# EAGLE design DCDC-5VXV3A (EAGLE 9.6.2)
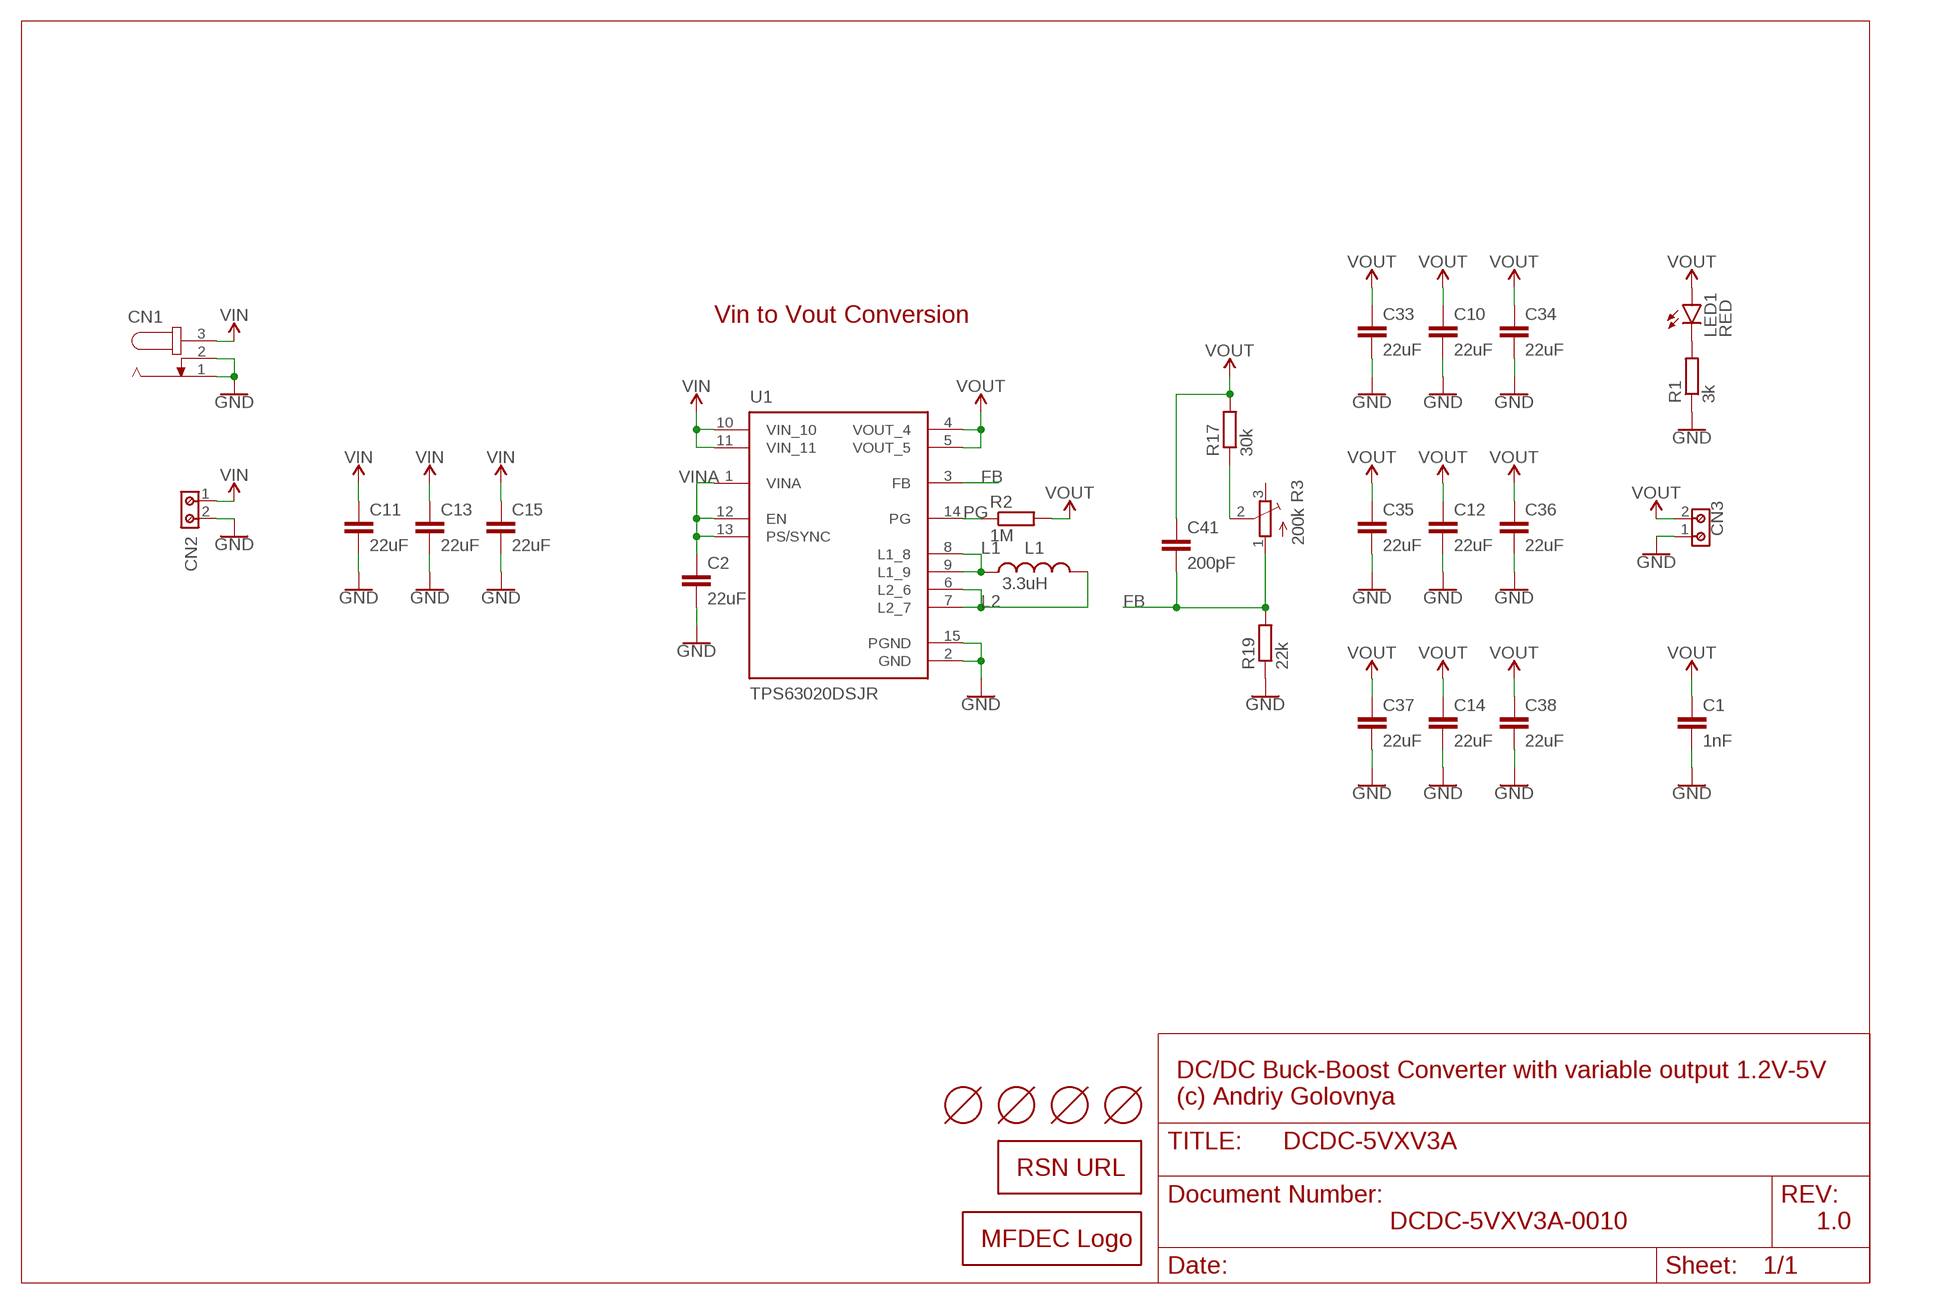
[diagram p0: schematic, sheet 1]

## Parts
C1  1nF  C-EUC0603K  [C0603K]
C2  22uF  C-EUC0805K  [C0805K]
C10  22uF  C-EUC0805K  [C0805K]
C11  22uF  C-EUC0805K  [C0805K]
C12  22uF  C-EUC0805K  [C0805K]
C13  22uF  C-EUC0805K  [C0805K]
C14  22uF  C-EUC0805K  [C0805K]
C15  22uF  C-EUC0805K  [C0805K]
C33  22uF  C-EUC0805K  [C0805K]
C34  22uF  C-EUC0805K  [C0805K]
C35  22uF  C-EUC0805K  [C0805K]
C36  22uF  C-EUC0805K  [C0805K]
C37  22uF  C-EUC0805K  [C0805K]
C38  22uF  C-EUC0805K  [C0805K]
C41  200pF  C-EUC0603K  [C0603K]
CN1  JACK-PLUG1  [SPC4078]
CN2  691213510002  [691213510002]
CN3  691213510002  [691213510002]
HOLE1  TOOLINGHOLE  [TOOLING-HOLE]
HOLE2  TOOLINGHOLE  [TOOLING-HOLE]
HOLE3  TOOLINGHOLE  [TOOLING-HOLE]
HOLE4  TOOLINGHOLE  [TOOLING-HOLE]
L1  3.3uH  WE-CHSA_1011_7843330330  [WE-CHSA_1011]
LED1  RED  LEDSML0603  [SML0603]
LOGO1  RSNURL_QR_8MM  [RSNURL_QR_8MM]
LOGO2  MFDECLOGO_L_10MM  [MFDEC_L_10MM]
R1  3k  R-EU_R0603  [R0603]
R2  1M  R-EU_R0603  [R0603]
R3  200k  TRIMPOTTC33X  [TC33X]
R17  30k  R-EU_R0603  [R0603]
R19  22k  R-EU_R0603  [R0603]
U1  TPS63020DSJR  [IC_TPS63020DSJR]

## Nets
FB: C41.2 R3.1(A) R19.2 U1.3(FB)
GND: C1.2 C2.2 C10.2 C11.2 C12.2 C13.2 C14.2 C15.2 C33.2 C34.2 C35.2 C36.2 C37.2 C38.2 CN1.1 CN1.2 CN2.2 CN3.1 R1.1 R19.1 U1.2(GND) U1.15(PGND)
L1: L1.1 U1.8(L1_8) U1.9(L1_9)
L2: L1.2 U1.6(L2_6) U1.7(L2_7)
N$1: LED1.C R1.2
N$2: R3.2(S) R17.1
PG: R2.1 U1.14(PG)
VIN: C11.1 C13.1 C15.1 CN1.3 CN2.1 U1.10(VIN_10) U1.11(VIN_11)
VINA: C2.1 U1.1(VINA) U1.12(EN) U1.13(PS/SYNC)
VOUT: C1.1 C10.1 C12.1 C14.1 C33.1 C34.1 C35.1 C36.1 C37.1 C38.1 C41.1 CN3.2 LED1.A R2.2 R17.2 U1.4(VOUT_4) U1.5(VOUT_5)
Unconnected: R3.3(E)

## Notes on the sheet
- Vin to Vout Conversion
- DC/DC Buck-Boost Converter with variable output 1.2V-5V
  (c) Andriy Golovnya
- DCDC-5VXV3A-0010 | 1.0

## Library data of the parts
C1 C2 C10-C15 C33-C38 C41 = rcl:C-EU: CAPACITOR, European symbol; SPICEPREFIX: C
CN1 = con-jack:JACK-PLUG: DC POWER JACK Power Jack, DC, Right Angle, Through Hole, Rated 5A at 16VDC, PC Terminals Distributor: Farnell (www.Farnell.de) Drawing: 84N1161.pdf / 84N1162.pdf Manufacturer: SPC Technology (www.spctechnology.com) Type: SPC4077 / SPC 4078; OC_FARNELL: unknown; OC_NEWARK: unknown
CN2 CN3 = Wurth_Connectors_WR-TBL Rising Cage Clamp:691213510002: WR-TBL Serie 2135 - 5.08 mm Horizontal Entry Modular w. Rising Cage Clamp KIND PROPERTIES Pitch 5.08 mm MATERIAL PROPERTIES Insulator Material PA66 Insulator Flammability Rating UL94 V-0 Contact Material Copper Alloy Contact Plating Tin over Nickel Contact Type Stamped Terminal Screw Material Steel Terminal Screw Plating Zinc Wire Guard Material Copper Alloy GENERAL INFORMATION Operating Temperature -30 up to +120 °C Compliance ROHS & Reach ELECTRICAL PROPERTIES IR UL 14 A IR VDE 14 A Working Voltage [UL] 300 V (AC) Working Voltage [VDE] 250 V (AC) Withstanding Voltage [UL] 1600 V (AC) Withstanding Voltage [VDE] 2000 V (AC) Contact Resistance 20 mΩ MECHANICAL PROPERTIES Wire Strip Length 6 Screw M3 CERTIFICATION UL Approval E150931 VDE Approval 40021366 PACKAGING PROPERTIES Packaging Box <https://www.we-online.com/catalog/media/o32805v209%20Family_WR-TBL2_Series2135.jpg> Details see: https://www.we-online.com/catalog/en/TBL_5_08_2135_HORIZONTAL_ENTRY_MODULAR_69121351000x/ Updated by Ella Wu 2019-11-26 2019(C) Wurth Elektronik; IR-UL: 14A; IR-VDE: 14A; PART-NUMBER: 691213510002; PINS: 2; PITCH: 5.08mm; TYPE: Horizontal; WIRE: 14 to 30 (AWG) 2.08 to 0.0509 (mm²); WORKING-VOLTAGE-UL: 300V (AC); WORKING-VOLTAGE-VDE: 250V (AC)
HOLE1-HOLE4 = _my_fiducia:TOOLINGHOLE: JLCPCB Tooling Hole
L1 = Wurth_Automotive_WE-CHSA:WE-CHSA_1011: WE-CHSA SMD High Current Inductor Characteristics Magnetically shielded rod core inductor Operating temperature: -55°C to +150°C Current capability up to 28A Ideal coplanarity due to embedded solder pads Applications Filter choke for motor electronics Car infotainment Multimedia applications <https://www.we-online.com/katalog/media/xo107952v209,P20Family_WE-CHSA_78433xxxx_Gruppe_4C.jpg.pagespeed.ic.AyH6nYZeiv.jpg> Details see: https://www.we-online.com/catalog/en/WE-CHSA Updated by Ella Wu 2021-05-13 2021 (C) Wurth Elektronik; DATASHEET-URL: https://www.we-online.com/catalog/datasheet/7843330330.pdf; FRES: 55MHz; IR: 13.8A; ISAT: 20.5A; MOUNT: SMT; PART-NUMBER: 7843330330; RDC-MAX: 6.5mohm; RDC-TYPE: 5.4mohm
LED1 = led:LED: LED OSRAM: - CHIPLED LG R971, LG N971, LY N971, LG Q971, LY Q971, LO R971, LY R971 LH N974, LH R974 LS Q976, LO Q976, LY Q976 LO Q996 - Hyper CHIPLED LW Q18S LB Q993, LB Q99A, LB R99A - SideLED LS A670, LO A670, LY A670, LG A670, LP A670 LB A673, LV A673, LT A673, LW A673 LH A674 LY A675 LS A676, LA A676, LO A676, LY A676, LW A676 LS A679, LY A679, LG A679 - Hyper Micro SIDELED® LS Y876, LA Y876, LO Y876, LY Y876 LT Y87S - SmartLED LW L88C, LW L88S LB L89C, LB L89S, LG L890 LS L89K, LO L89K, LY L89K LS L896, LA L896, LO L896, LY L896 - TOPLED LS T670, LO T670, LY T670, LG T670, LP T670 LSG T670, LSP T670, LSY T670, LOP T670, LYG T670 LG T671, LOG T671, LSG T671 LB T673, LV T673, LT T673, LW T673 LH T674 LS T676, LA T676, LO T676, LY T676, LB T676, LH T676, LSB T676, LW T676 LB T67C, LV T67C, LT T67C, LS T67K, LO T67K, LY T67K, LW E67C LS E67B, LA E67B, LO E67B, LY E67B, LB E67C, LV E67C, LT E67C LW T67C LS T679, LY T679, LG T679 LS T770, LO T770, LY T770, LG T770, LP T770 LB T773, LV T773, LT T773, LW T773 LH T774 LS E675, LA E675, LY E675, LS T675 LS T776, LA T776, LO T776, LY T776, LB T776 LHGB T686 LT T68C, LB T68C - Hyper Mini TOPLED® LB M676 - Mini TOPLED Santana® LG M470 LS M47K, LO M47K, LY M47K Source: http://www.osram.convergy.de LUXEON: - LUMILED® LXK2-PW12-R00, LXK2-PW12-S00, LXK2-PW14-U00, LXK2-PW14-V00 LXK2-PM12-R00, LXK2-PM12-S00, LXK2-PM14-U00 LXK2-PE12-Q00, LXK2-PE12-R00, LXK2-PE12-S00, LXK2-PE14-T00, LXK2-PE14-U00 LXK2-PB12-K00, LXK2-PB12-L00, LXK2-PB12-M00, LXK2-PB14-N00, LXK2-PB14-P00, LXK2-PB14-Q00 LXK2-PR12-L00, LXK2-PR12-M00, LXK2-PR14-Q00, LXK2-PR14-R00 LXK2-PD12-Q00, LXK2-PD12-R00, LXK2-PD12-S00 LXK2-PH12-R00, LXK2-PH12-S00 LXK2-PL12-P00, LXK2-PL12-Q00, LXK2-PL12-R00 Source: www.luxeon.com KINGBRIGHT: KA-3528ASYC Source: www.kingbright.com
LOGO1 = _my_logos:RSNURL: RedScorp.Net URL
LOGO2 = _my_logos:MFDECLOGO: Midnight Fog - Digital Eye Candy LOGO
R1 R2 R17 R19 = rcl:R-EU_: RESISTOR, European symbol; SPICEPREFIX: R
R3 = adafruit:TRIMPOT: SMT trimmer potentiometer part number TC33X http://www.ladyada.net/library/eagle
U1 = TPS63020DSJR:TPS63020DSJR: High Efficiency Single Inductor Buck-Boost Converter with 4A Switch Buy Part <https://snapeda.com/parts/TPS63020DSJR/Texas%20Instruments/view-part/?ref=eda> Check prices <https://snapeda.com/parts/TPS63020DSJR/Texas%20Instruments/view-part/?ref=eda> Check prices <https://pricing.snapeda.com/parts/TPS63020DSJR/Texas%20Instruments/view-part?ref=eda>; AVAILABILITY: In Stock; DESCRIPTION: High Efficiency Single Inductor Buck-Boost Converter with 4A Switch 14-VSON -40 to 85; MF: Texas Instruments; MP: TPS63020DSJR; PACKAGE: VSON-14 Texas Instruments; PRICE: None; PURCHASE-URL: https://pricing.snapeda.com/search/part/TPS63020DSJR/?ref=eda

## Net classes
0 default: width 0.254 mm

## Board
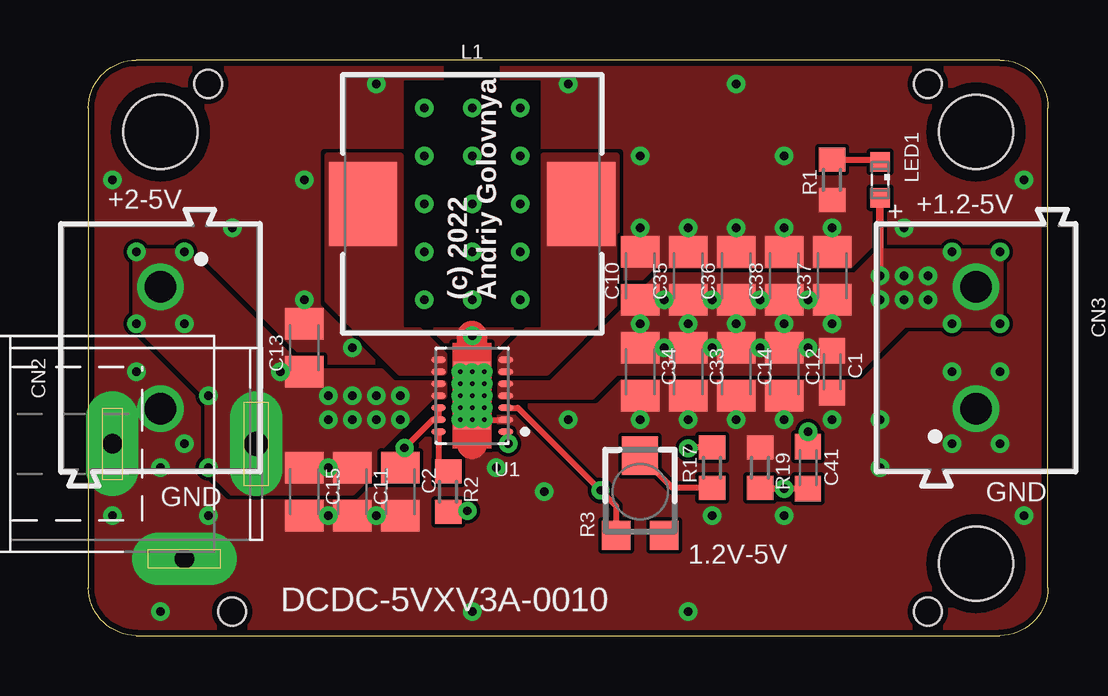
[diagram p1: board, top side]
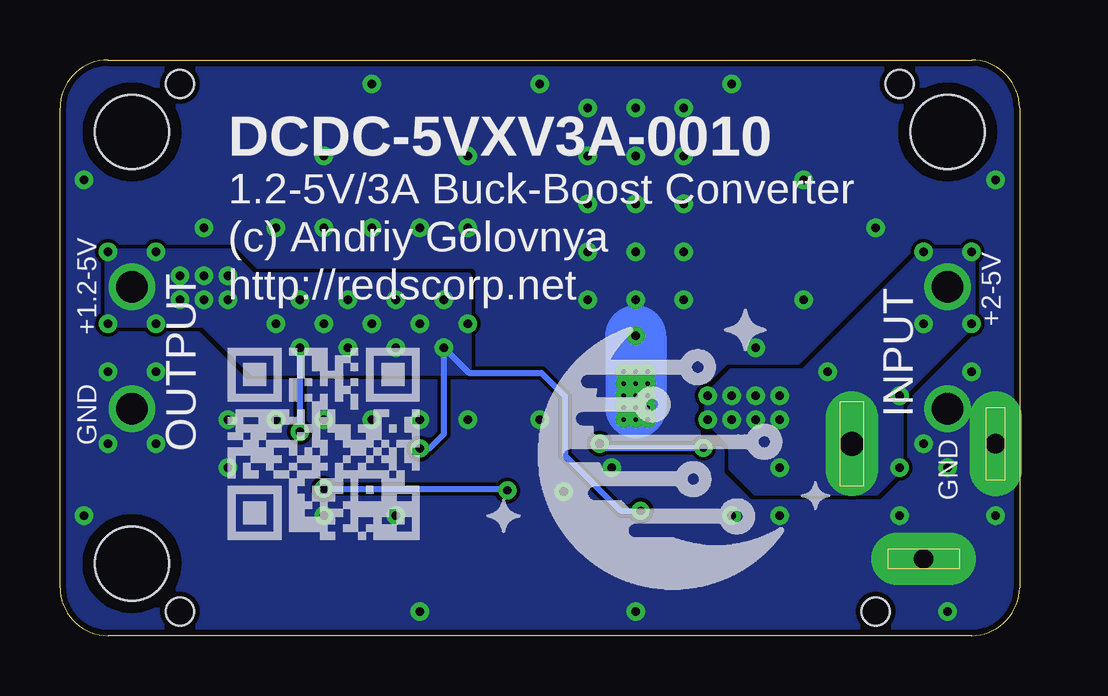
[diagram p2: board, bottom side, seen from below]

Size 40 x 24 mm. Coordinates in mm from the lower left corner, seen from the top.
Outline: 2,0 38,0 arc90 40,2 40,22 arc90 38,24 2,24 arc90 0,22 0,2 arc90 2,0
Copper layers (1*16): Top 0.035mm / dielectric 1.5mm / Bottom 0.035mm
Design rules "default *": minimum track width 6mil, minimum drill 0.35mm, track to track 6mil, track to pad 6mil, pad to pad 6mil, via to via 6mil, smd to smd 6mil, copper to edge 10mil, drill to drill 6mil, minimum pad ring 10mil, minimum via ring 8mil, stop-mask expansion 4mil, vias tented up to drill 20mil, thermal gap 10mil
Holes 3.1 mm at 3,21 37,21 37,3

### Footprints (pad centres in the part's own frame; a part is rotated, then mirrored left to right if it is on the bottom)
C0603K = smd 1.05 x 1.08: 1 -0.875,0; 2 0.875,0
C0805K = smd 1.3 x 1.6: 1 -1,0; 2 1,0
SPC4078 = drill 0.8 pad 2.184 long: 1 -3,0; 2 0,-4.8 | drill 1 pad 2.184 long: 3 3,0
691213510002 = drill 1.3: 1 -2.54,0; 2 2.54,0
TOOLING-HOLE = hole 1.153: 0,0
WE-CHSA_1011 = smd 2.85 x 3.5: 1 -4.55,0; 2 4.55,0
SML0603 = smd 0.8 x 0.8: A 0.75,0; C -0.75,0
R0603 = smd 1 x 1.1: 1 -0.85,0; 2 0.85,0
TC33X = smd 1.2 x 1.2: 1 -1,-1.825; 3 1,-1.825 | smd 1.5 x 1.6: 2 0,1.5
IC_TPS63020DSJR = smd 0.6 x 0.24: 1 -1.4,1.5; 2 -1.4,1; 3 -1.4,0.5; 4 -1.4,0; 5 -1.4,-0.5; 6 -1.4,-1; 7 -1.4,-1.5; 8 1.4,-1.5; 9 1.4,-1; 10 1.4,-0.5; 11 1.4,0; 12 1.4,0.5; 13 1.4,1; 14 1.4,1.5 | smd 1.5 x 2.8: 15 0,0 | drill 0.2 pad 0.3: 16 -0.5,1; 17 0,1; 18 0.5,1; 19 -0.5,0.5; 20 0,0.5; 21 0.5,0.5; 22 -0.5,0; 23 0,0; 24 0.5,0; 25 -0.5,-0.5; 26 0,-0.5; 27 0.5,-0.5; 28 -0.5,-1; 29 0,-1; 30 0.5,-1

### Placement (x,y rotation side)
C1  31,11 270 top
C2  13,6 270 top
C10  23,15 90 top
C11  11,6 270 top
C12  29,11 270 top
C13  9,12 90 top
C14  27,11 270 top
C15  9,6 270 top
C33  25,11 270 top
C34  23,11 270 top
C35  25,15 90 top
C36  27,15 90 top
C37  31,15 90 top
C38  29,15 90 top
C41  30,7 270 top
CN1  4,8 0 top
CN2  3,12 270 top
CN3  37,12 90 top
HOLE1  35,23 0 top
HOLE2  5,23 0 top
HOLE3  35,1 0 top
HOLE4  6,1 0 top
L1  16,18 0 top
LED1  33,19 270 top
LOGO1  33,4 0 bottom
LOGO2  23,1 0 bottom
R1  31,19 90 top
R2  15,6 270 top
R3  23,6 0 top
R17  26,7 90 top
R19  28,7 270 top
U1  16,10 180 top

### Tracks (layer width: path | path; a pad name or v marks a point on that pad's centre or on a via)
FB  (via drill 0.35)
  Top 0.254: C41.2 v29,6.12 28.02,6.12 R19.2 | U1.3 17.9,9.5 v21.35,6.05 22,5.4 R3.1
  Bottom 0.254: v29,6.12 21.43,6.12 v21.35,6.05
GND  (via drill 0.35)
  Top 0.254: U1.15 16,9.5 16.5,9 U1.2
  Top 1.27: v16,12.5 16,8
  Bottom 2.54: v16,12.5 16,9.5
  other vias: 33,9 33,7 39,19 39,5 3,7 5,5 1,5 1,19 38,11 36,11 38,8 36,8 4,8 2,11 3,1 12,5 25,1 16,1 14,18 14,20 14,22 14,16 14,14 16,16 18,14 18,16 18,22 18,20 18,18 16,18 16,20 16,22 16,14 23,17 25,17 27,17 29,17 31,17 29,9 27,9 25,9 23,9 31,9 11,12 20,9 12,23 20,23 27,23 17,7 10,5 9,14 9,19 6,17 23,20 29,20 34,17 19,6 26,5 29,5
  pour Top (rank 3, no thermals): 40,0 -5,0 -5,24 40,24
  pour Bottom (rank 3, no thermals): 0,24 0,0 45,0 45,24
  cutout Top: 37,1 arc-180 37,5 arc-180
  cutout Top: 37,19 arc-180 37,23 arc-180
  cutout Top: 3,19 arc-180 3,23 arc-180
  cutout Bottom: 3,19 arc-180 3,23 arc-180
  cutout Bottom: 37,19 arc-180 37,23 arc-180
  cutout Bottom: 37,1 arc-180 37,5 arc-180
L1
  pour Top (no thermals): 14.8,11 14.8,11.7 13,13.5 13,20 10,20 10,14 13,11
L2
  pour Top (no thermals): 17.2,11 17.2,11.6 19,13.4 19,20 22,20 22,13.9 19.1,11
N$1
  Top 0.254: R1.2 32.9,19.85 LED1.C
N$2
  Top 0.254: R17.1 24.35,6.15 R3.2
PG
  Top 0.254: U1.14 14.6,7.25 R2.1
VIN  (via drill 0.35)
  other vias: 4,16 4,13 5,10 12,10 12,9 11,10 11,9 10,10 10,9 10,7 2,13 13,10 5,7 8,11 13,9 2,16
  pour Top (no thermals): 2,16 2,13 5,10 5,7 6,6 11,6 12,7 12,7.7 14.3,10 14.8,10 14.8,10.5 12.7,10.5 12.2,11 9,11 4,16
  pour Bottom (no thermals): 2,16 2,13 5,10 5,7 6,6 11,6 12,7 12,8 13,9 13,10 12,11 9,11 4,16
VINA  (via drill 0.35)
  Top 0.254: U1.12 U1.13 14.36,9.01 v13.18,7.82 13,7.64 C2.1 | v17.5,8 17.4,8.1 U1.1
  Bottom 0.254: v17.5,8 17.5,7.95 17.38,7.82 v13.18,7.82
VOUT  (via drill 0.35)
  Top 0.254: C41.1 v30,8.5 | v15.8,5.2 15.75,5.15 R2.2 | R17.2 25.05,7.85 v25,7.8
  Top 0.305: LED1.A v33,15
  Bottom 0.254: v30,8.5 v30,12 | v25,7.8 24.6,7.8 24,8.4 v24,12 22.96,10.96 19.93,10.96 18.94,9.97 18.94,7.51 16.63,5.2 v15.8,5.2
  other vias: 35,15 35,14 34,15 34,14 33,14 24,14 26,14 28,14 30,14 28,12 26,12 38,16 38,13 23,13 25,13 27,13 29,13 31,13 36,16 36,13
  pour Top (no thermals): 17.2,10.5 19.3,10.5 23.8,15 32,15 33,16 38,16 38,13 34,13 32,11 22,11 21,10 17.2,10
  pour Bottom (no thermals): 23,15 23,11 32,11 34,13 38,13 38,16 33,16 32,15

### Text on the board
Top: (c) 2022 / Andriy Golovnya
tPlace: +2-5V | +1.2-5V | + | (c) 2022 / Andriy Golovnya | GND | GND | 1.2V-5V | DCDC-5VXV3A-0010
bPlace: DCDC-5VXV3A-0010 | 1.2-5V/3A Buck-Boost Converter | +1.2-5V | +2-5V | (c) Andriy Golovnya | OUTPUT | INPUT | http://redscorp.net | GND | GND